# Altium project HeartAware.PrjPcb
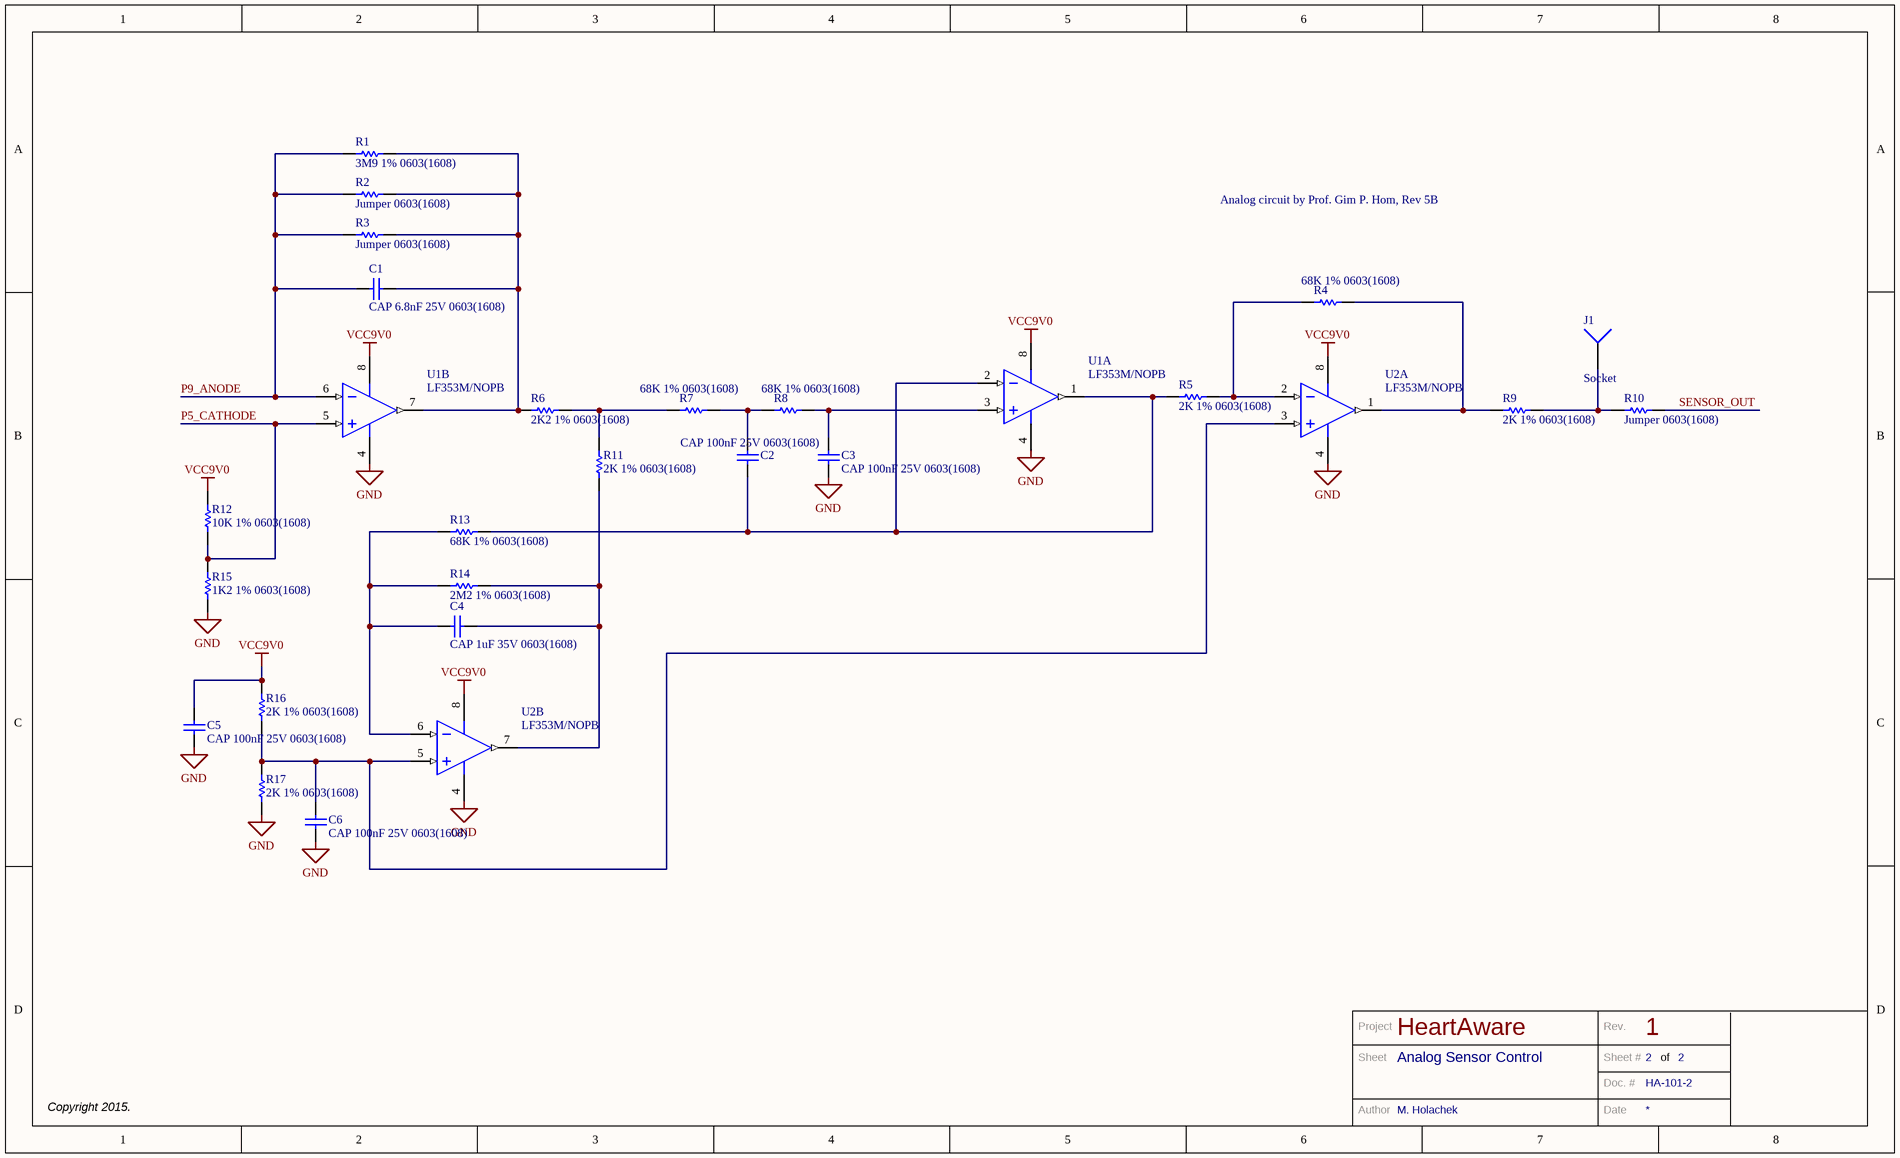
[diagram p0: HeartAware_AnalogSensorControl.SchDoc]
2 sheets, 70 parts. Net scope: global (net labels, ports and power ports of the same name join across sheets).
Board file: HeartAware.PcbDoc
Sheets:
  HeartAware_AnalogSensorControl.SchDoc
  HeartAware_Main.SchDoc

## Sheet HeartAware_AnalogSensorControl.SchDoc: Analog Sensor Control
size Legal; Author: M. Holachek; DocumentNumber: HA-101-2; Revision: 1; SheetNumber: 2; SheetTotal: 2; Copyright: Copyright 2015.; ProjectName: HeartAware

### Parts
C1  CAP 6.8nF 25V 0603(1608)  [CAPC0603(1608)100_N]
C2  CAP 100nF 25V 0603(1608)  [CAPC0603(1608)100_M]
C3  CAP 100nF 25V 0603(1608)  [CAPC0603(1608)100_M]
C4  CAP 1uF 35V 0603(1608)  [CAPC0603(1608)100_L]
C5  CAP 100nF 25V 0603(1608)  [CAPC0603(1608)100_M]
C6  CAP 100nF 25V 0603(1608)  [CAPC0603(1608)100_M]
J1  Socket  [PIN1]
R1  3M9 1% 0603(1608)  [RESC0603(1608)_M]
R2  Jumper 0603(1608)  [RESC0603(1608)_N]
R3  Jumper 0603(1608)  [RESC0603(1608)_N]
R4  68K 1% 0603(1608)  [RESC0603(1608)_M]
R5  2K 1% 0603(1608)  [RESC0603(1608)_N]
R6  2K2 1% 0603(1608)  [RESC0603(1608)_L]
R7  68K 1% 0603(1608)  [RESC0603(1608)_M]
R8  68K 1% 0603(1608)  [RESC0603(1608)_M]
R9  2K 1% 0603(1608)  [RESC0603(1608)_N]
R10  Jumper 0603(1608)  [RESC0603(1608)_N]
R11  2K 1% 0603(1608)  [RESC0603(1608)_N]
R12  10K 1% 0603(1608)  [RESC0603(1608)_N]
R13  68K 1% 0603(1608)  [RESC0603(1608)_M]
R14  2M2 1% 0603(1608)  [RESC0603(1608)_M]
R15  1K2 1% 0603(1608)  [RESC0603(1608)_M]
R16  2K 1% 0603(1608)  [RESC0603(1608)_N]
R17  2K 1% 0603(1608)  [RESC0603(1608)_N]
U1  LF353M/NOPB  [M08A_M]  (parts A,B of 2)
U2  LF353M/NOPB  [M08A_M]  (parts A,B of 2)

### Nets
GND: C3.1 C5.1 C6.1 R15.1 R17.1 U1.4(V-) U2.4(V-)
VCC9V0: C5.2 R12.1 R16.2 U1.8(V+) U2.8(V+)
P5_CATHODE: R12.2 R15.2 U1.5(INB+)
P9_ANODE: C1.1 R1.1 R2.1 R3.1 U1.6(INB-)
SENSOR_OUT: R10.2
NetC1_2: C1.2 R1.2 R2.2 R3.2 R6.1 U1.7(OUTB)
NetC2_1: C2.1 R5.1 R13.1 U1.1(OUTA) U1.2(INA-)
NetC2_2: C2.2 R7.2 R8.1
NetC3_2: C3.2 R8.2 U1.3(INA+)
NetC4_1: C4.1 R13.2 R14.1 U2.6(INB-)
NetC4_2: C4.2 R11.1 R14.2 U2.7(OUTB)
NetC6_2: C6.2 R16.1 R17.2 U2.3(INA+) U2.5(INB+)
NetJ1_1: J1.1 R9.2 R10.1
NetR4_1: R4.1 R5.2 U2.2(INA-)
NetR4_2: R4.2 R9.1 U2.1(OUTA)
NetR6_2: R6.2 R7.1 R11.2

### Notes on the sheet
- Analog circuit by Prof. Gim P. Hom, Rev 5B
- Project
- Rev.
- Sheet
- Author
- Doc. #
- Sheet #
- Date
- of

### Library data of the parts
C1 = CMP-1035-02265-1: CAP 6.8nF 25V Â±20% 0603 (1608 Metric) Thickness 1mm SMD; Case-EIA: 0603; Case-Metric: 1608; Tolerance: Â±20%; Technology: SMT; Value: 6.8nF; Rated Voltage: 25 V; Max Thickness: 1 mm
C2 C3 C5 C6 = CMP-1035-02588-1: CAP 100nF 25V Â±10% 0603 (1608 Metric) Thickness 1mm SMD; Case-Metric: 1608; Case-EIA: 0603; Max Thickness: 1 mm; Technology: SMT; Rated Voltage: 25 V; Value: 100nF; Tolerance: Â±10%
C4 = CMP-1035-02743-1: CAP 1uF 35V Â±10% 0603 (1608 Metric) Thickness 1mm SMD; Case-Metric: 1608; Case-EIA: 0603; Max Thickness: 1 mm; Value: 1uF; Technology: SMT; Rated Voltage: 35 V; Tolerance: Â±10%
R1 = CMP-1012-00915-1: 3M9 0.1W 1% 0603 (1608 Metric)  SMD; Case-EIA: 0603; Case-Metric: 1608; Value: 3900000.00 Ohm; Power: 0.1 W; Technology: SMT; Tolerance: 1 %
R2 R3 R10 = CMP-1012-00001-1: Jumper 0603 (1608 Metric); Case-Metric: 1608; Value: 0.00 Ohm; Power: None; Case-EIA: 0603; Technology: SMT; Tolerance: None
R4 R7 R8 R13 = CMP-1012-00717-1: 68K 0.1W 1% 0603 (1608 Metric)  SMD; Value: 68000.00 Ohm; Case-EIA: 0603; Case-Metric: 1608; Power: 0.1 W; Technology: SMT; Tolerance: 1 %
R5 R9 R11 R16 R17 = CMP-1012-00542-1: 2K 0.1W 1% 0603 (1608 Metric)  SMD; Case-EIA: 0603; Value: 2000.00 Ohm; Case-Metric: 1608; Power: 0.1 W; Technology: SMT; Tolerance: 1 %
R6 = CMP-1012-00546-1: 2K2 0.1W 1% 0603 (1608 Metric)  SMD; Case-EIA: 0603; Value: 2200.00 Ohm; Case-Metric: 1608; Tolerance: 1 %; Power: 0.1 W; Technology: SMT
R12 = CMP-1012-00623-1: 10K 0.1W 1% 0603 (1608 Metric)  SMD; Value: 10000.00 Ohm; Case-EIA: 0603; Case-Metric: 1608; Power: 0.1 W; Tolerance: 1 %; Technology: SMT
R14 = CMP-1012-00885-1: 2M2 0.1W 1% 0603 (1608 Metric)  SMD; Case-EIA: 0603; Value: 2200000.00 Ohm; Case-Metric: 1608; Tolerance: 1 %; Power: 0.1 W; Technology: SMT
R15 = CMP-1012-00518-1: 1K2 0.1W 1% 0603 (1608 Metric)  SMD; Case-EIA: 0603; Value: 1200.00 Ohm; Case-Metric: 1608; Power: 0.1 W; Technology: SMT; Tolerance: 1 %
U1 U2 = CMP-0055-00856-2: Wide Bandwidth Dual JFET Input Operational Amplifier, 8-pin Narrow SOIC, Pb-Free; Manufacturer: National Semiconductor; PowerWise: N; CompType: Amplifiers; PackageTopMarking: NSZXTT*LF353*M; ComponentLink1URL: http://www.national.com/ds/LF/LF353.pdf; PackageReference: M08A; RevisionNote: Component URLs added; ComponentLink3Description: M08A Package Page; ComponentLink1Description: LF353 Datasheet; Code_IPC: SOIC127P600-8; Code_JEDEC: MS-012-AA; ComponentLink2Description: LF353 Web Page; RoHS: Y; PackageDescription: SOIC Narrow, 4.9 x 3.9 x 1.45mm, 8 Lead, 1.27mm Pitch; DatasheetVersion: Dec-2003; PackageVersion: revM, May-2009; PinCount: 8; ComponentLink3URL: http://www.national.com/packaging/folders/m08a.html; ComponentLink2URL: http://www.national.com/pf/LF/LF353.html
J1 = Socket: LatestRevisionDate: 17-Jul-2002; LatestRevisionNote: Re-released for DXP Platform.; Publisher: Altium Limited

## Sheet HeartAware_Main.SchDoc: Main
size Legal; Author: M. Holachek; DocumentNumber: HA-101-1; Revision: 1; SheetNumber: 1; SheetTotal: 2; Copyright: Copyright 2015.; ProjectName: HeartAware
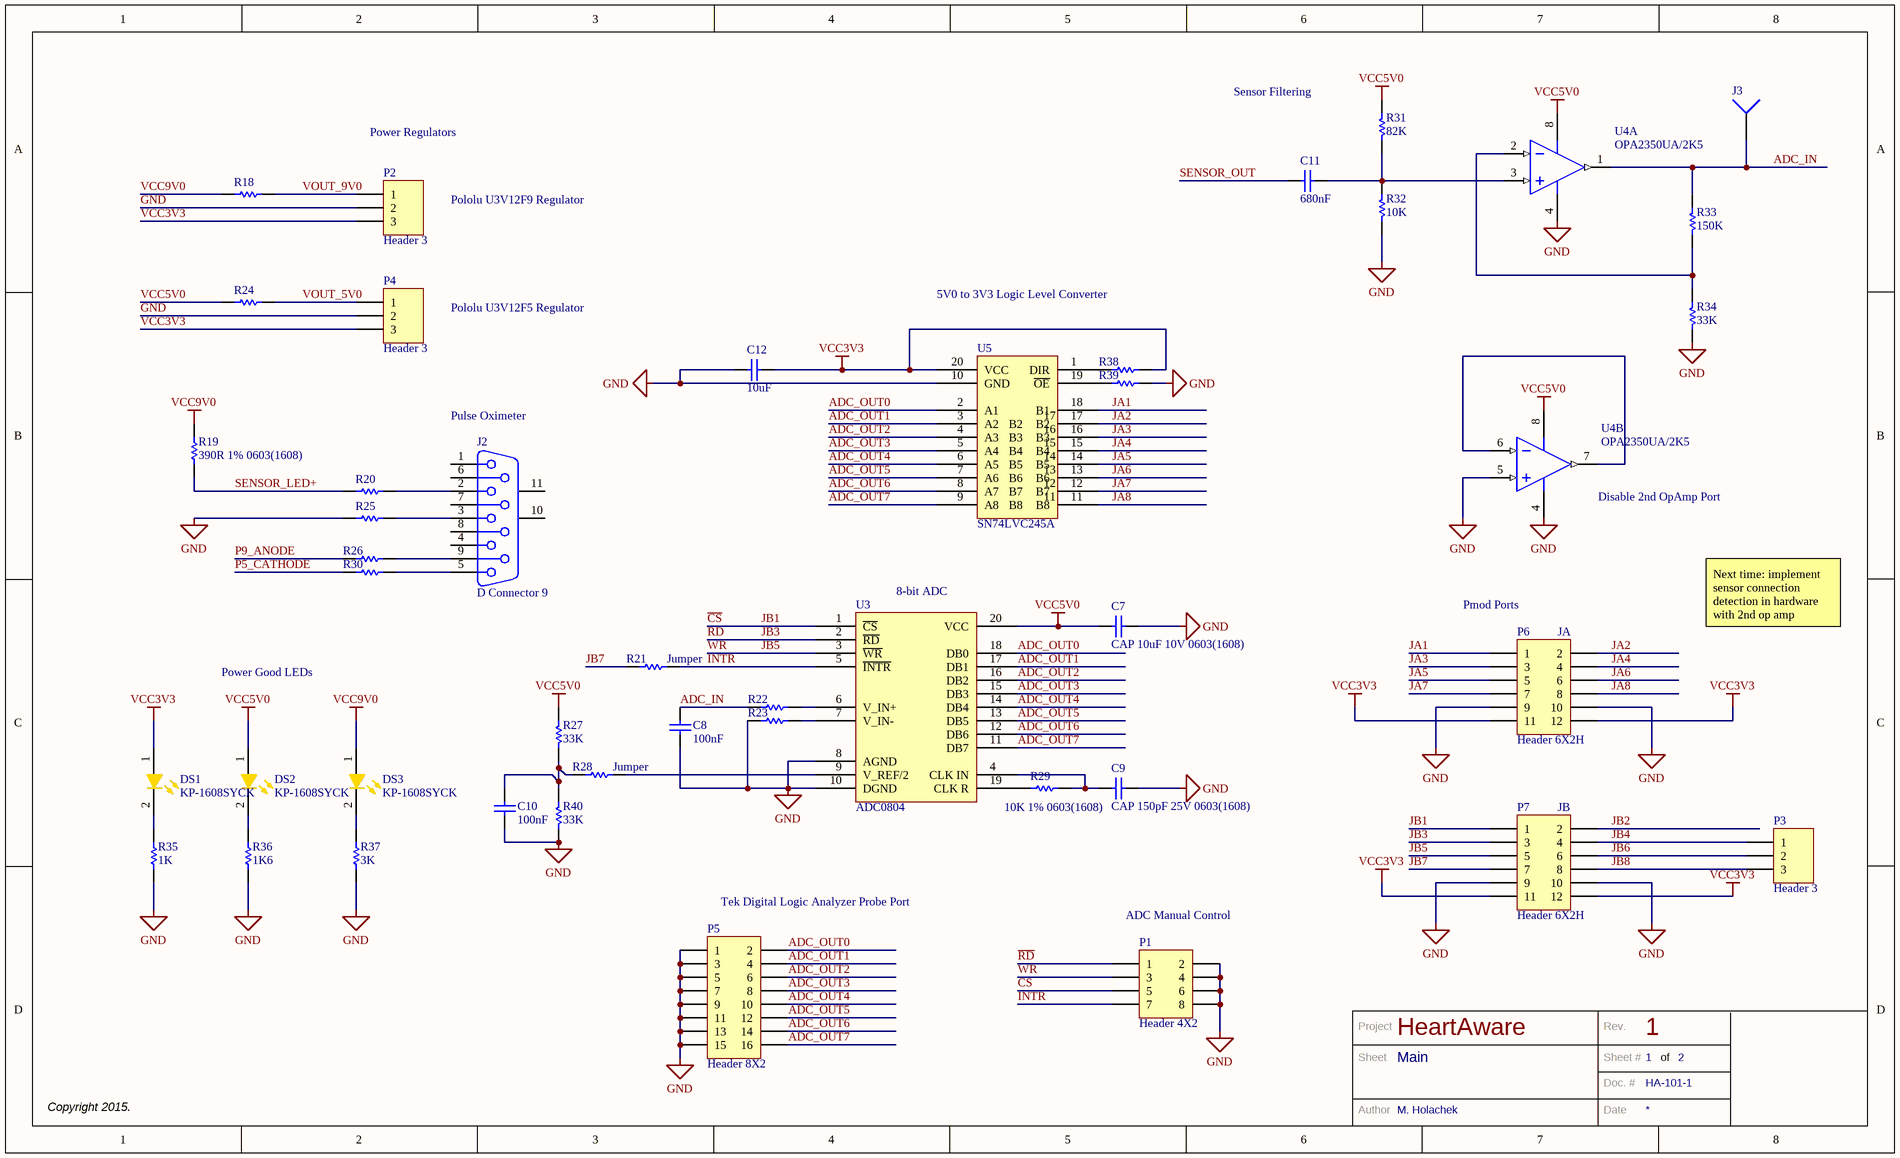
[diagram p1: HeartAware_Main.SchDoc]

### Parts
C7  CAP 10uF 10V 0603(1608)  [CAPC0603(1608)100_N]
C8  100nF  [CAPC0603(1608)100_M]
C9  CAP 150pF 25V 0603(1608)  [CAPC0603(1608)100_L]
C10  100nF  [CAPC0603(1608)100_M]
C11  680nF  [CAPC0603(1608)100_N]
C12  10uF  [CAPC0603(1608)100_N]
DS1  KP-1608SYCK  [KING-0603LED_YELLOW_V]
DS2  KP-1608SYCK  [KING-0603LED_YELLOW_V]
DS3  KP-1608SYCK  [KING-0603LED_YELLOW_V]
J2  D Connector 9  [DSUB1.385-2H9]
J3  Socket  [PIN1]  (value not drawn)
P1  Header 4X2  [HDR2X4]
P2  Header 3  [HDR1X3]
P3  Header 3  [HDR1X3]
P4  Header 3  [HDR1X3]
P5  Header 8X2  [HDR2X8]
P6  Header 6X2H  [HDR2X6H]
P7  Header 6X2H  [HDR2X6H]
R18  Jumper 0603(1608)  [RESC0603(1608)_N]  (value not drawn)
R19  390R 1% 0603(1608)  [RESC0603(1608)_L]
R20  Jumper 0603(1608)  [RESC0603(1608)_N]  (value not drawn)
R21  Jumper  [RESC0603(1608)_N]
R22  Jumper  [RESC0603(1608)_N]  (value not drawn)
R23  Jumper  [RESC0603(1608)_N]  (value not drawn)
R24  Jumper 0603(1608)  [RESC0603(1608)_N]  (value not drawn)
R25  Jumper 0603(1608)  [RESC0603(1608)_N]  (value not drawn)
R26  Jumper 0603(1608)  [RESC0603(1608)_N]  (value not drawn)
R27  33K  [RESC0603(1608)_N]
R28  Jumper  [RESC0603(1608)_N]
R29  10K 1% 0603(1608)  [RESC0603(1608)_N]
R30  Jumper 0603(1608)  [RESC0603(1608)_N]  (value not drawn)
R31  82K  [RESC0603(1608)_N]
R32  10K  [RESC0603(1608)_N]
R33  150K  [RESC0603(1608)_L]
R34  33K  [RESC0603(1608)_N]
R35  1K  [RESC0603(1608)_M]
R36  1K6  [RESC0603(1608)_L]
R37  3K  [RESC0603(1608)_N]
R38  Jumper 0603(1608)  [RESC0603(1608)_N]  (value not drawn)
R39  Jumper 0603(1608)  [RESC0603(1608)_N]  (value not drawn)
R40  33K  [RESC0603(1608)_N]
U3  ADC0804  [SOIC127P1030X265-20N]
U4  OPA2350UA/2K5  [TI-D8_M]  (parts A,B of 2)
U5  SN74LVC245A  [SOIC127P780X200-20N]

### Nets
GND: C7.1 C8.1 C9.2 C10.1 C12.2 P1.2 P1.4 P1.6 P1.8 P2.2 P4.2 P5.1 P5.3 P5.5 P5.7 P5.9 P5.11 P5.13 P5.15 P6.9 P6.10 P7.9 P7.10 R23.1 R25.1 R32.2 R34.2 R35.1 R36.1 R37.1 R39.2 R40.2 U3.8(AGND) U3.10(DGND) U4.4(V-) U4.5(IN_B+) U5.10(GND)
VCC3V3: C12.1 DS1.1(A) P2.3 P4.3 P6.11 P6.12 P7.11 P7.12 R38.2 U5.20(VCC)
VCC5V0: C7.2 DS2.1(A) R24.1 R27.1 R31.1 U3.20(VCC) U4.8(V+)
VCC9V0: DS3.1(A) R18.1 R19.2
~{CS}: P1.5 P7.1 U3.1(~{CS})  [also labelled JB1]
~{INTR}: P1.7 R21.2 U3.5(~{INTR})
~{RD}: P1.1 P7.3 U3.2(~{RD})  [also labelled JB3]
~{WR}: P1.3 P7.5 U3.3(~{WR})  [also labelled JB5]
ADC_IN: C8.2 J3.1 R22.1 R33.1 U4.1(OUT_A)
ADC_OUT0: P5.2 U3.18(DB0) U5.2(A1)
ADC_OUT1: P5.4 U3.17(DB1) U5.3(A2)
ADC_OUT2: P5.6 U3.16(DB2) U5.4(A3)
ADC_OUT3: P5.8 U3.15(DB3) U5.5(A4)
ADC_OUT4: P5.10 U3.14(DB4) U5.6(A5)
ADC_OUT5: P5.12 U3.13(DB5) U5.7(A6)
ADC_OUT6: P5.14 U3.12(DB6) U5.8(A7)
ADC_OUT7: P5.16 U3.11(DB7) U5.9(A8)
JA1: P6.1 U5.18(B1)
JA2: P6.2 U5.17(B2)
JA3: P6.3 U5.16(B3)
JA4: P6.4 U5.15(B4)
JA5: P6.5 U5.14(B5)
JA6: P6.6 U5.13(B6)
JA7: P6.7 U5.12(B7)
JA8: P6.8 U5.11(B8)
JB2: P7.2
JB4: P3.1 P7.4
JB6: P3.2 P7.6
JB7: P7.7 R21.1
JB8: P3.3 P7.8
P5_CATHODE: R30.1
P9_ANODE: R26.1
SENSOR_LED+: R19.1 R20.1
SENSOR_OUT: C11.1
VOUT_5V0: P4.1 R24.2
VOUT_9V0: P2.1 R18.2
NetC9_1: C9.1 R29.2 U3.4(CLK_IN)
NetC10_2: C10.2 R27.2 R28.1 R40.1
NetC11_2: C11.2 R31.2 R32.1 U4.3(IN_A+)
NetDS1_2: DS1.2(K) R35.2
NetDS2_2: DS2.2(K) R36.2
NetDS3_2: DS3.2(K) R37.2
NetJ2_2: J2.2 R20.2
NetJ2_3: J2.3 R25.2
NetJ2_5: J2.5 R30.2
NetJ2_9: J2.9 R26.2
NetR22_2: R22.2 U3.6(V_IN+)
NetR23_2: R23.2 U3.7(V_IN-)
NetR28_2: R28.2 U3.9(V_REF/2)
NetR29_1: R29.1 U3.19(CLK_R)
NetR33_2: R33.2 R34.1 U4.2(IN_A-)
NetR38_1: R38.1 U5.1(DIR)
NetR39_1: R39.1 U5.19(~{OE})
NetU4_6: U4.6(IN_B-) U4.7(OUT_B)

Not connected (* = marked no-connect by the designer): J2 1 4 6 7 8 10(MH1) 11(MH2)

### Notes on the sheet
- Sensor Filtering
- Power Regulators
- Pololu U3V12F9 Regulator
- 5V0 to 3V3 Logic Level Converter
- Pololu U3V12F5 Regulator
- (near J2) Pulse Oximeter
- (near U4) Disable 2nd OpAmp Port
- (near U3) 8-bit ADC
- (near P6) Pmod Ports
- (near P6) JA
- Next time: implement sensor connection detection in hardware with 2nd op amp
- Power Good LEDs
- (near P7) JB
- (near P5) Tek Digital Logic Analyzer Probe Port
- (near P1) ADC Manual Control
- Project
- Rev.
- Sheet
- Author
- Doc. #
- Sheet #
- Date
- of

### Library data of the parts
C7 C12 = CMP-1035-02799-1: CAP 10uF 10V Â±10% 0603 (1608 Metric) Thickness 1mm SMD; Case-Metric: 1608; Case-EIA: 0603; Max Thickness: 1 mm; Tolerance: Â±10%; Technology: SMT; Rated Voltage: 10 V; Value: 10uF
C8 C10 = CMP-1035-02588-1: as C2 on sheet HeartAware_AnalogSensorControl; Max Thickness: 1 mm; Technology: SMT; Rated Voltage: 25 V; Value: 100nF; Tolerance: Â±10%
C9 = CMP-1035-01361-1: CAP 150pF 25V Â±2% 0603 (1608 Metric) Thickness 1mm SMD; Case-EIA: 0603; Case-Metric: 1608; Rated Voltage: 25 V; Max Thickness: 1 mm; Value: 150pF; Technology: SMT; Tolerance: Â±2%
C11 = CMP-1035-02722-1: CAP 680nF 25V Â±10% 0603 (1608 Metric) Thickness 1mm SMD; Case-Metric: 1608; Case-EIA: 0603; Max Thickness: 1 mm; Value: 680nF; Technology: SMT; Rated Voltage: 25 V; Tolerance: Â±10%
DS1-DS3 = CMP-0404-00003-1: LED, SMT, 0603(1608), 1.1mm thickness, Yellow; Manufacturer: Kingbright; Reverse Voltage: 5 V; Packing Type: 2000 pcs / reel; Forward Current: 30 mA; Power Dissipation: 75 mW; ComponentLink2URL: http://www.kingbright.com/manager/upload/pdf/(1366274739)KP-1608SYCK(Ver.18B).pdf; PartNumber: KP-1608SYCK; ComponentLink1URL: http://www.kingbright.com/; ComponentLink2Description: Datasheet; PackageDescription: 2-Pin SMT LED, 1.6 x 0.8 mm Pitch; PackageReference: 0603LED_YELLOW; ComponentLink1Description: Manufacturer URL; Storage Temperature: -40 to +85 degC; Mounting Technology: Surface Mount
J2 = D Connector 9: Receptacle Assembly, 9 Position, Right Angle; PackageDocument: O; Positions: 9; Published: 15-Jun-2001; LatestRevisionDate: 17-Jul-2002; LatestRevisionNote: Re-released for DXP Platform.; DatasheetDocument: 1-Sep-1999; PackageReference: 788750; Publisher: Altium Limited; Orientation: Right Angle; Gender: Receptacle
P1 = Header 4X2: Header, 4-Pin, Dual row; LatestRevisionDate: 17-Jul-2002; LatestRevisionNote: Re-released for DXP Platform.; Publisher: Altium Limited
P2-P4 = Header 3: Header, 3-Pin; LatestRevisionDate: 17-Jul-2002; LatestRevisionNote: Re-released for DXP Platform.; Publisher: Altium Limited
P5 = Header 8X2: Header, 8-Pin, Dual row; LatestRevisionDate: 17-Jul-2002; LatestRevisionNote: Re-released for DXP Platform.; Publisher: Altium Limited
P6 P7 = Header 6X2H: Header, 6-Pin, Dual row, Right Angle; LatestRevisionDate: 17-Jul-2002; LatestRevisionNote: Re-released for DXP Platform.; Publisher: Altium Limited
R18 R20-R26 R28 R30 R38 R39 = CMP-1012-00001-1: as R2 on sheet HeartAware_AnalogSensorControl; Technology: SMT; Tolerance: None
R19 = CMP-1012-00463-1: 390R 0.1W 1% 0603 (1608 Metric)  SMD; Case-EIA: 0603; Value: 390.00 Ohm; Case-Metric: 1608; Power: 0.1 W; Tolerance: 1 %; Technology: SMT
R27 R34 R40 = CMP-1012-00680-1: 33K 0.1W 1% 0603 (1608 Metric)  SMD; Case-EIA: 0603; Value: 33000.00 Ohm; Case-Metric: 1608; Tolerance: 1 %; Power: 0.1 W; Technology: SMT
R29 R32 = CMP-1012-00623-1: as R12 on sheet HeartAware_AnalogSensorControl; Power: 0.1 W; Tolerance: 1 %; Technology: SMT
R31 = CMP-1012-00726-1: 82K 0.1W 1% 0603 (1608 Metric)  SMD; Case-Metric: 1608; Value: 82000.00 Ohm; Case-EIA: 0603; Tolerance: 1 %; Power: 0.1 W; Technology: SMT
R33 = CMP-1012-00754-1: 150K 0.1W 1% 0603 (1608 Metric)  SMD; Case-EIA: 0603; Case-Metric: 1608; Value: 150000.00 Ohm; Tolerance: 1 %; Power: 0.1 W; Technology: SMT
R35 = CMP-1012-00510-1: 1K 0.1W 1% 0603 (1608 Metric)  SMD; Case-Metric: 1608; Case-EIA: 0603; Value: 1000.00 Ohm; Technology: SMT; Tolerance: 1 %; Power: 0.1 W
R36 = CMP-1012-00531-1: 1K6 0.1W 1% 0603 (1608 Metric)  SMD; Value: 1600.00 Ohm; Case-EIA: 0603; Case-Metric: 1608; Tolerance: 1 %; Technology: SMT; Power: 0.1 W
R37 = CMP-1012-00562-1: 3K 0.1W 1% 0603 (1608 Metric)  SMD; Value: 3000.00 Ohm; Case-EIA: 0603; Case-Metric: 1608; Power: 0.1 W; Technology: SMT; Tolerance: 1 %
U3 = ADC0804: 8-Bit Parallel Analog-to-Digital Converter
U4 = CMP-0272-00732-2: High-Speed, Single-Supply, Rail-to-Rail Operational Amplifier MicroAmplifier(TM) Series, 2.7 to 5.5 V, -40 to 85 degC, 8-pin SOIC (D8), Green (RoHS & no Sb/Br); Manufacturer: Texas Instruments; Slew Rate(Typ)(V/us): 22; Sub Family: Low Input Bias Current Amp (<=10pA), Low Offset Voltage Amplifier (<=500uV), Low Supply Voltage Amplifier (<=2.7V), Precision Amplifier; Offset Drift(Typ)(uV/C): 4; Vn at 1kHz(Typ)(nV/rtHz): 18; Number of Channels: 2; Total Supply Voltage(Min)(+5V is 5, +/-5V is 10): 2.7; Vio (25C)(Max)(mV): 1; Iq per channel(Max)(mA): 8.5; Total Supply Voltage(Max)(+5V is 5, +/-5V is 10): 5.5; IIB(Max)(pA): 10; CMRR(Min)(dB): 74; ComponentLink1URL: http://www.ti.com/; PackageReference: D8; Eco-Plan: Green (RoHS & no Sb/Br); ComponentLink2Description: Datasheet; ComponentLink1Description: Manufacturer URL; ComponentLink2URL: http://www.ti.com/general/docs/lit/getliterature.tsp?genericPartNumber=OPA2350&fileType=pdf; Code_JEDEC: MS-012; PackageVersion: 4040047-3/M, 06/2011; Mounting Technology: Surface Mount; PackageDescription: 8-Pin Plastic Small Outline, Body 4.9 x 3.9 mm, Pitch 1.27 mm; PartNumber: OPA2350UA/2K5; DatasheetVersion: SBOS099C; ComponentLink3URL: http://www.ti.com/litv/pdf/msoi002j; ComponentLink3Description: Package Specification
U5 = SN74LVC245A: Octal Bus Tranceiver With 3-State Outputs
J3 = Socket: LatestRevisionDate: 17-Jul-2002; LatestRevisionNote: Re-released for DXP Platform.; Publisher: Altium Limited

## Nets that join several sheets
GND: HeartAware_AnalogSensorControl (7 pins), HeartAware_Main (37 pins)
VCC9V0: HeartAware_AnalogSensorControl (5 pins), HeartAware_Main (DS3.1 R18.1 R19.2)
P5_CATHODE: HeartAware_AnalogSensorControl (R12.2 R15.2 U1.5), HeartAware_Main (R30.1)
P9_ANODE: HeartAware_AnalogSensorControl (5 pins), HeartAware_Main (R26.1)
SENSOR_OUT: HeartAware_AnalogSensorControl (R10.2), HeartAware_Main (C11.1)